# EAGLE design TSL230 v10 (EAGLE 6.2)
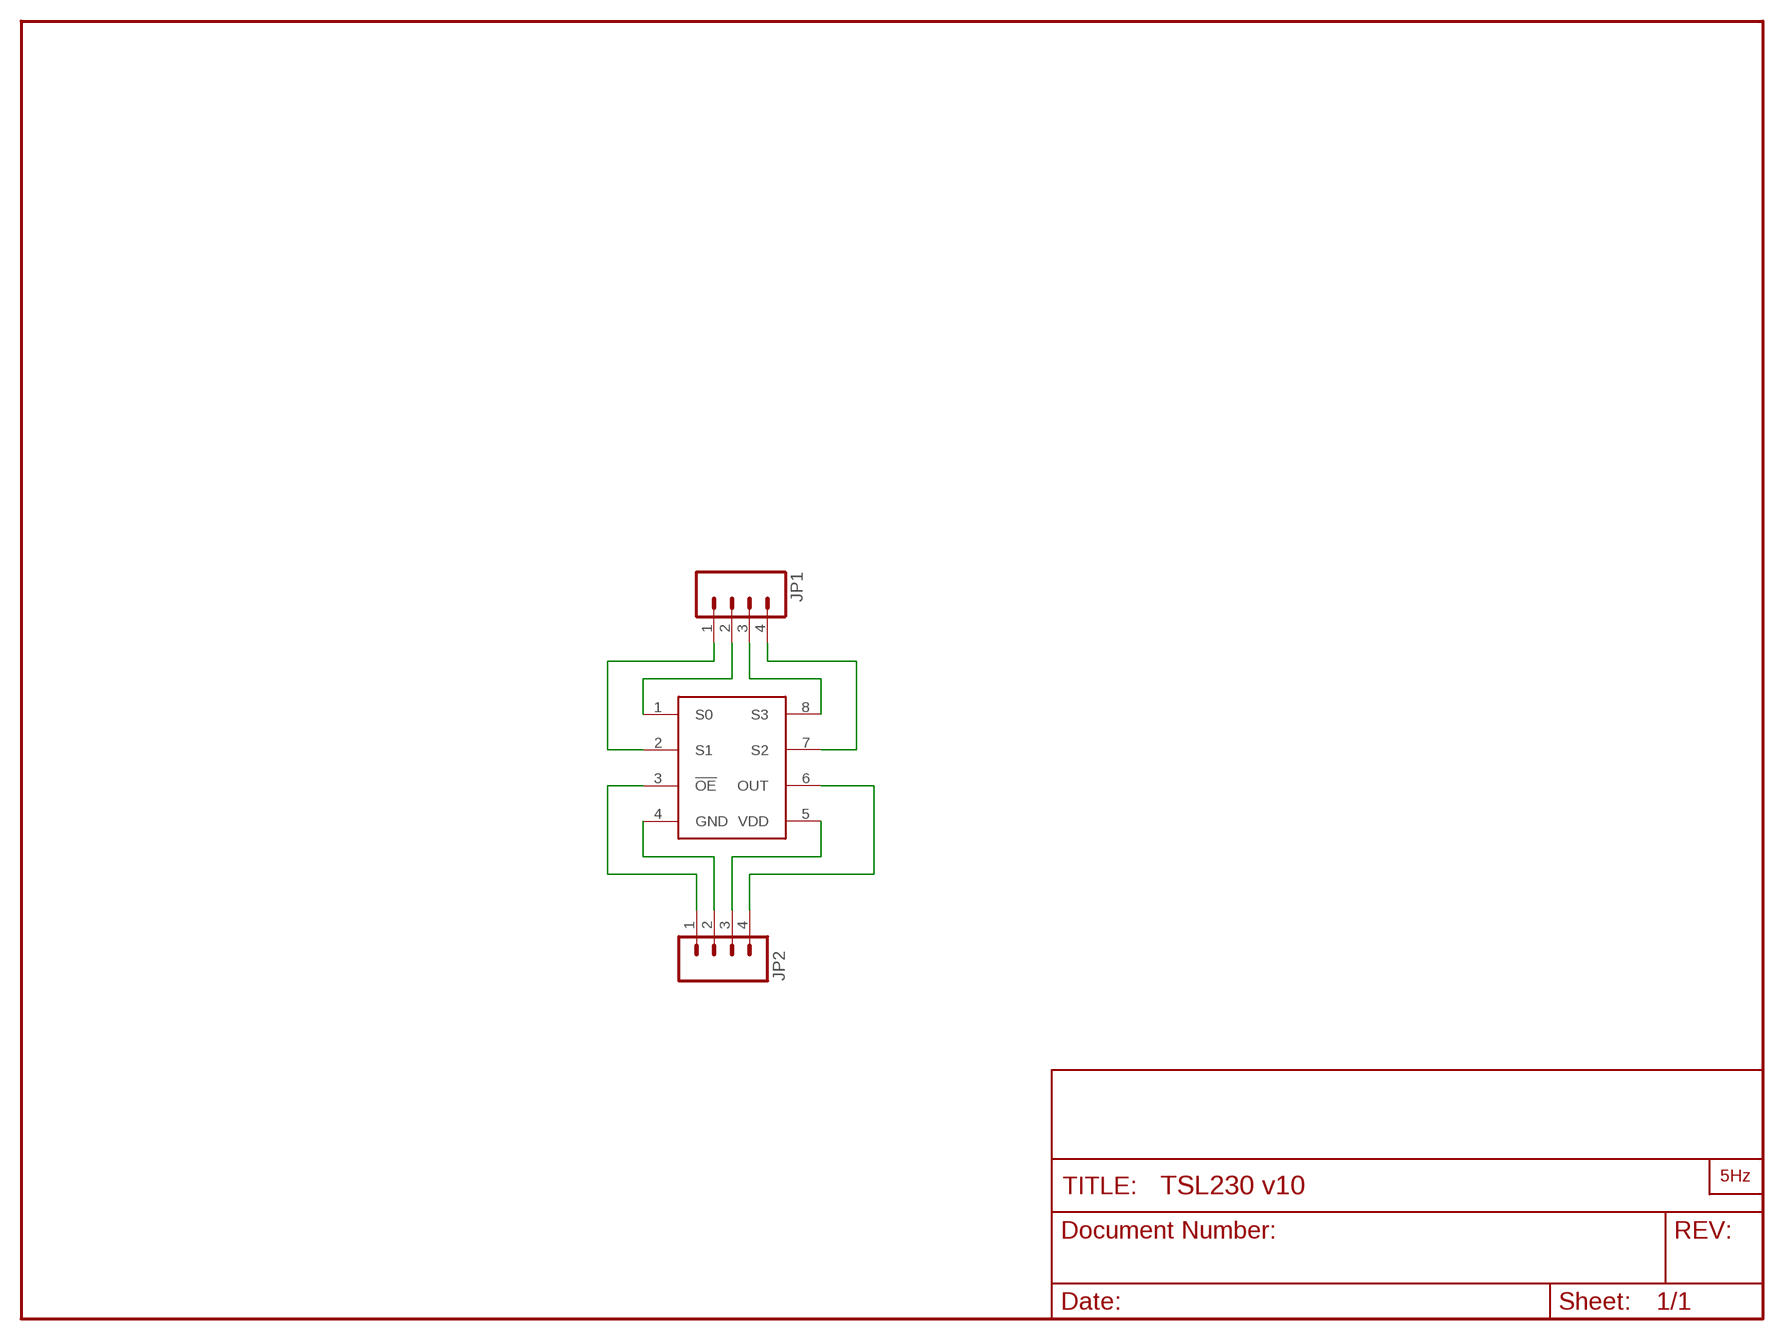
[diagram p0: schematic, sheet 1]

## Parts
JP1  M04PTH  [1X04]
JP2  M04PTH  [1X04]
U$1  TSL230RD  [SOIC8]
U$2  LOGO2_SILKL5MM  [LARGO2_5MM]

## Nets
N$1: JP2.1 U$1.3(!OE)
N$2: JP2.2 U$1.4(GND)
N$3: JP2.4 U$1.6(OUT)
N$4: JP2.3 U$1.5(VDD)
N$5: JP1.1 U$1.2(S1)
N$6: JP1.2 U$1.1(S0)
N$7: JP1.3 U$1.8(S3)
N$8: JP1.4 U$1.7(S2)

## Library data of the parts
JP1 JP2 = SparkFun:M04: Header 4 Standard 4-pin 0.1" header. Use with straight break away headers (SKU : PRT-00116), right angle break away headers (PRT-00553), swiss pins (PRT-00743), machine pins (PRT-00117), and female headers (PRT-00115). Molex polarized connector foot print use with SKU : PRT-08231 with associated crimp pins and housings. 1MM SMD Version SKU: PRT-10208
U$1 = MAÑE:TSL230RD
U$2 = LOGO:LOGO2_SILK: PRINCIPAL

## Board
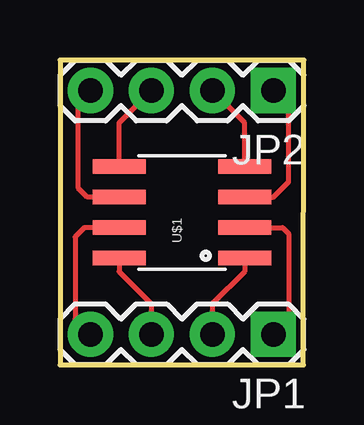
[diagram p1: board, top side]
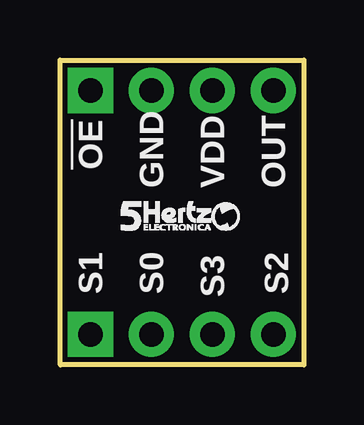
[diagram p2: board, bottom side, seen from below]

Size 10.16 x 12.7 mm. Coordinates in mm from the lower left corner, seen from the top.
Outline: 0,0 10.14,0 10.16,12.7 0,12.7 0,0
Copper layers (1*16): Top 0.035mm / dielectric 1.5mm / Bottom 0.035mm
Design rules: minimum track width 10mil, minimum drill 24mil, track to track 8mil, track to pad 8mil, pad to pad 8mil, via to via 8mil, smd to smd 8mil, copper to edge 40mil, drill to drill 8mil, minimum pad ring 10mil, minimum via ring 8mil, stop-mask expansion 4mil, vias tented up to drill 0mil, thermal gap 10mil

### Footprints (pad centres in the part's own frame; a part is rotated, then mirrored left to right if it is on the bottom)
1X04 = drill 1.016 pad 1.88 square: 1 0,0 | drill 1.016 pad 1.88: 2 2.54,0; 3 5.08,0; 4 7.62,0
SOIC8 = smd 0.61 x 2.21: 1 -1.905,-2.616; 2 -0.635,-2.616; 3 0.635,-2.616; 4 1.905,-2.616; 5 1.905,2.616; 6 0.635,2.616; 7 -0.635,2.616; 8 -1.905,2.616

### Placement (x,y rotation side)
JP1  8.89,1.27 180 top
JP2  8.89,11.43 180 top
U$1  5.08,6.35 90 top
U$2  7.62,5.59 0 bottom

### Tracks (layer width: path | path; a pad name or v marks a point on that pad's centre or on a via)
N$1
  Top 0.203: U$1.3 8.89,6.99 9.53,7.62 9.53,10.79 JP2.1
N$2
  Top 0.203: U$1.4 7.7,10.08 JP2.2
N$3
  Top 0.203: U$1.6 1.14,6.99 0.76,7.37 0.76,10.92 JP2.4
N$4
  Top 0.203: U$1.5 2.46,10.08 JP2.3
N$5
  Top 0.203: U$1.2 9.27,5.71 9.53,5.46 9.53,1.91 JP1.1
N$6
  Top 0.203: U$1.1 7.7,3.89 6.35,2.54 JP1.2
N$7
  Top 0.203: U$1.8 2.46,3.89 3.81,2.54 JP1.3
N$8
  Top 0.203: U$1.7 1.02,5.71 0.64,5.33 0.64,1.91 JP1.4

### Text on the board
bPlace: !OE | OUT | VDD | GND | S2 | S3 | S0 | S1